# EAGLE schematic base_board (EAGLE 9.6.2)
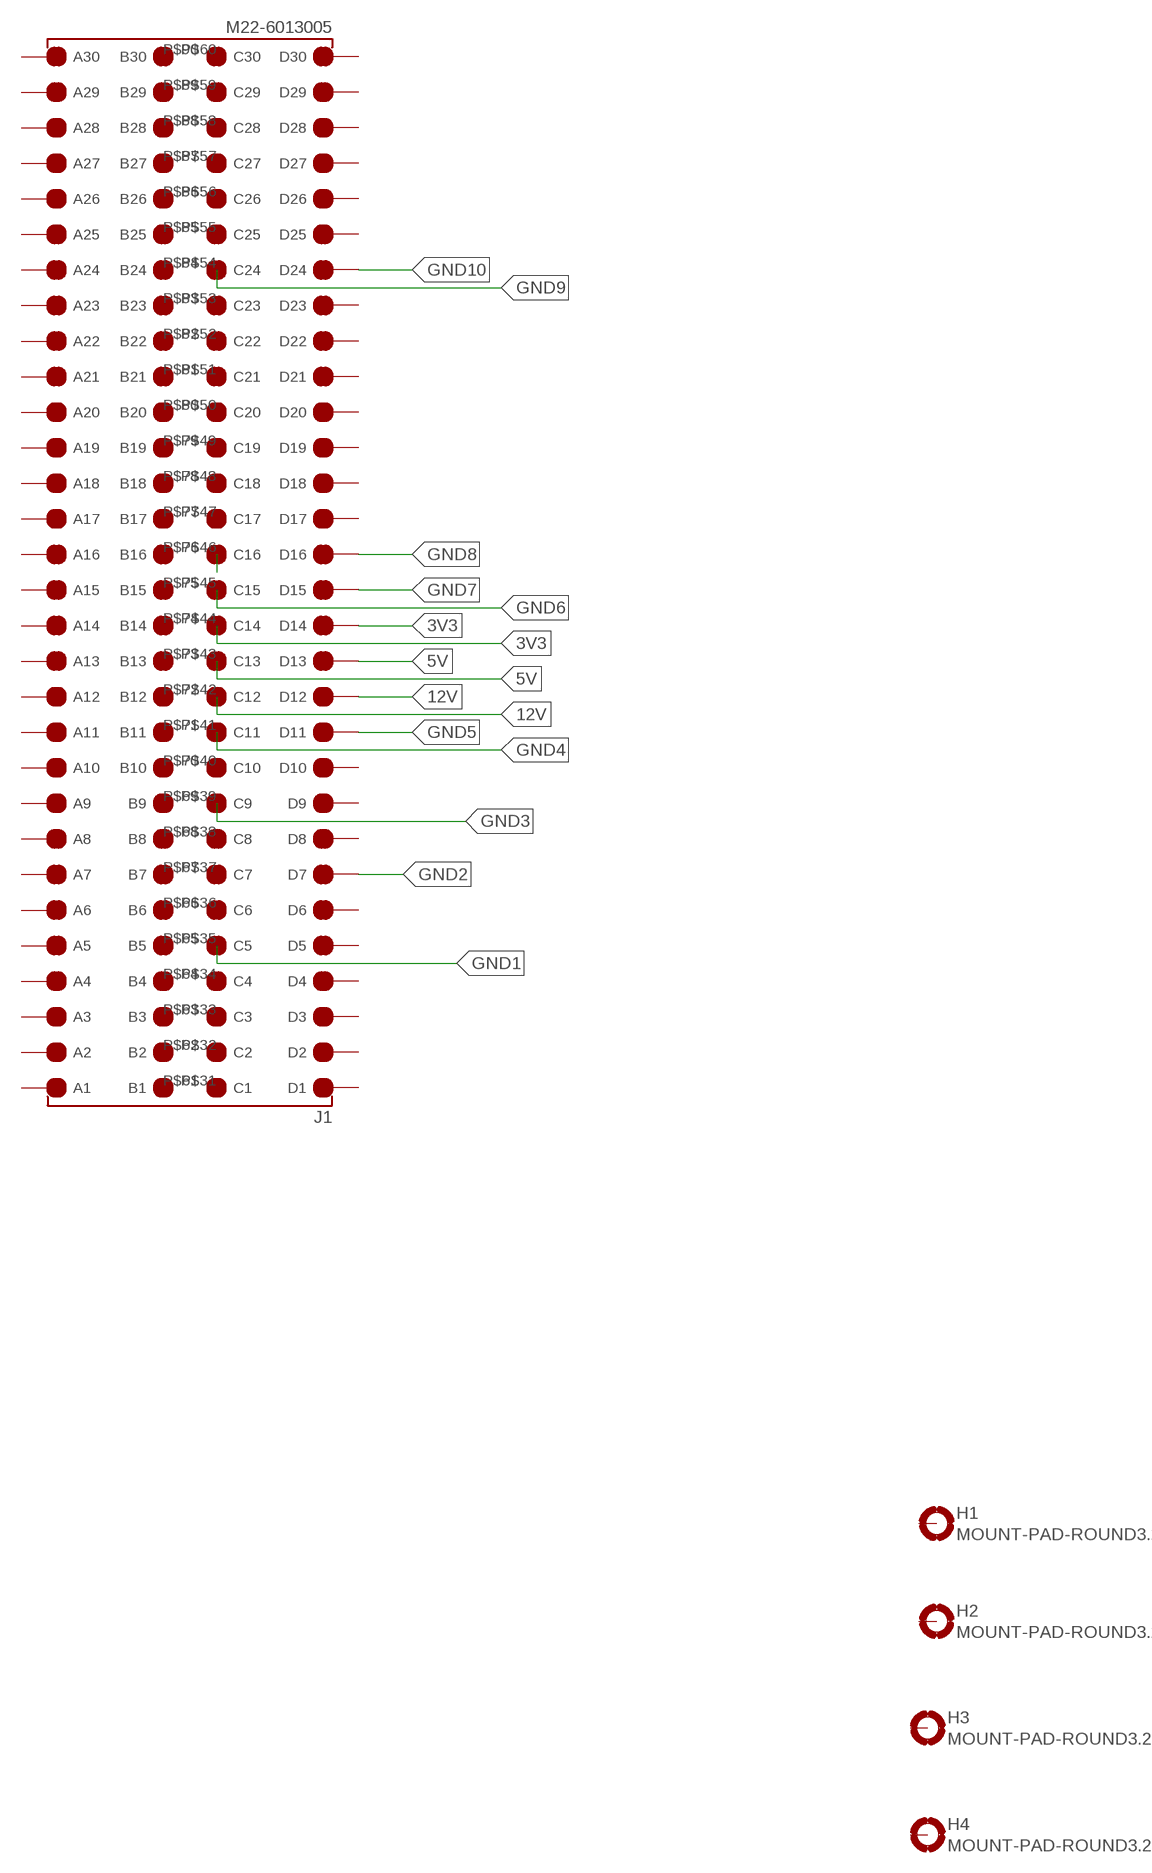
[diagram p0: schematic, sheet 1]

## Parts
H1  MOUNT-PAD-ROUND3.2  [3,2-PAD]
H2  MOUNT-PAD-ROUND3.2  [3,2-PAD]
H3  MOUNT-PAD-ROUND3.2  [3,2-PAD]
H4  MOUNT-PAD-ROUND3.2  [3,2-PAD]
J1  M22-6013005  [RHDR120W55P200_4X30_6020X820X9]

## Nets
3V3: J1.P$14(D14) J1.P$44(C14)
5V: J1.P$13(D13) J1.P$43(C13)
12V: J1.P$12(D12) J1.P$42(C12)
GND1: J1.P$35(C5)
GND2: J1.P$7(D7)
GND3: J1.P$39(C9)
GND4: J1.P$41(C11)
GND5: J1.P$11(D11)
GND6: J1.P$45(C15)
GND7: J1.P$15(D15)
GND8: J1.P$16(D16) J1.P$46(C16)
GND9: J1.P$54(C24)
GND10: J1.P$24(D24)
Unconnected: H1.B3,2(MOUNT) H2.B3,2(MOUNT) H3.B3,2(MOUNT) H4.B3,2(MOUNT) J1.P$1(D1) J1.P$2(D2) J1.P$3(D3) J1.P$4(D4) J1.P$5(D5) J1.P$6(D6) J1.P$8(D8) J1.P$9(D9) J1.P$10(D10) J1.P$17(D17) J1.P$18(D18) J1.P$19(D19) J1.P$20(D20) J1.P$21(D21) J1.P$22(D22) J1.P$23(D23) J1.P$25(D25) J1.P$26(D26) J1.P$27(D27) J1.P$28(D28) J1.P$29(D29) J1.P$30(D30) J1.P$31(C1) J1.P$32(C2) J1.P$33(C3) J1.P$34(C4) J1.P$36(C6) J1.P$37(C7) J1.P$38(C8) J1.P$40(C10) J1.P$47(C17) J1.P$48(C18) J1.P$49(C19) J1.P$50(C20) J1.P$51(C21) J1.P$52(C22) J1.P$53(C23) J1.P$55(C25) J1.P$56(C26) J1.P$57(C27) J1.P$58(C28) J1.P$59(C29) J1.P$60(C30) J1.P$61(B1) J1.P$62(B2) J1.P$63(B3) J1.P$64(B4) J1.P$65(B5) J1.P$66(B6) J1.P$67(B7) J1.P$68(B8) J1.P$69(B9) J1.P$70(B10) J1.P$71(B11) J1.P$72(B12) J1.P$73(B13) J1.P$74(B14) J1.P$75(B15) J1.P$76(B16) J1.P$77(B17) J1.P$78(B18) J1.P$79(B19) J1.P$80(B20) J1.P$81(B21) J1.P$82(B22) J1.P$83(B23) J1.P$84(B24) J1.P$85(B25) J1.P$86(B26) J1.P$87(B27) J1.P$88(B28) J1.P$89(B29) J1.P$90(B30) J1.P$91(A1) J1.P$92(A2) J1.P$93(A3) J1.P$94(A4) J1.P$95(A5) J1.P$96(A6) J1.P$97(A7) J1.P$98(A8) J1.P$99(A9) J1.P$100(A10) J1.P$101(A11) J1.P$102(A12) J1.P$103(A13) J1.P$104(A14) J1.P$105(A15) J1.P$106(A16) J1.P$107(A17) J1.P$108(A18) J1.P$109(A19) J1.P$110(A20) J1.P$111(A21) J1.P$112(A22) J1.P$113(A23) J1.P$114(A24) J1.P$115(A25) J1.P$116(A26) J1.P$117(A27) J1.P$118(A28) J1.P$119(A29) J1.P$120(A30)

## Library data of the parts
H1-H4 = holes:MOUNT-PAD-ROUND: MOUNTING PAD, round
J1 = M22-6013005:M22-6013005: HARWIN - M22-6013005 - PCB Receptacle, Board-to-Board, 2 mm, 4 Rows, 120 Contacts, Through Hole Mount, M22 Series Source: Datasheet <https://ms.componentsearchengine.com/Datasheets/2/M22-6013005.pdf>; DESCRIPTION: HARWIN - M22-6013005 - PCB Receptacle, Board-to-Board, 2 mm, 4 Rows, 120 Contacts, Through Hole Mount, M22 Series; HEIGHT: 9.65mm; MANUFACTURER_NAME: Harwin; MANUFACTURER_PART_NUMBER: M22-6013005